# Altium schematic sheet esp32.SchDoc
size A; SheetNumber: 3; SheetTotal: 4
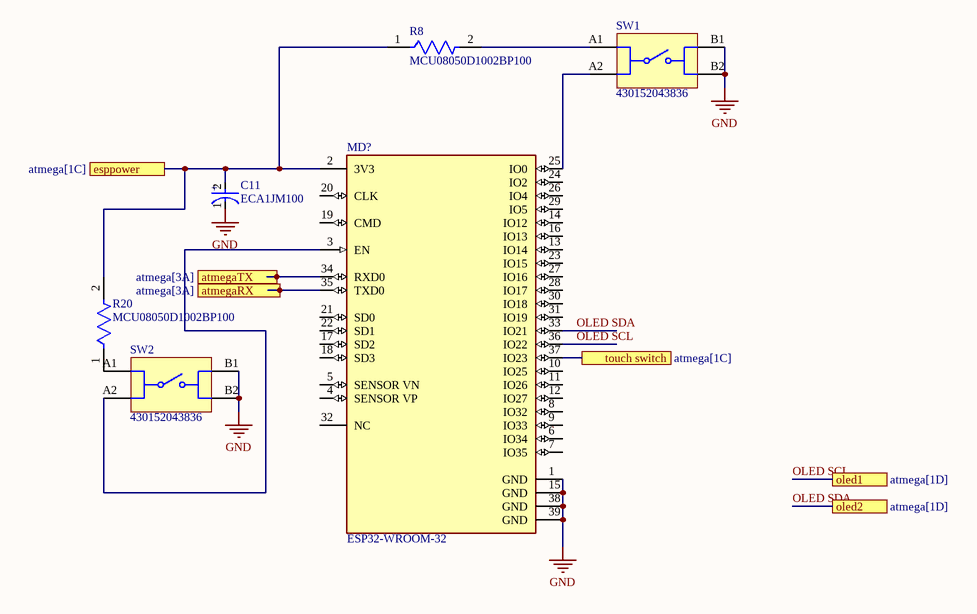
[diagram p0: esp32.SchDoc]

## Parts
C11  ECA1JM100  [FP-RAD-TH-D_5_0_5-L_11_1-MFG]
MD?  ESP32-WROOM-32  [FP-ESP32-WROOM-32-MFG]
R8  MCU08050D1002BP100  [FP-MCU0805-IPC_C]
R20  MCU08050D1002BP100  [FP-MCU0805-IPC_C]
SW1  430152043836  [WS-TASV_L6W6H4.3_4301x20438x6]
SW2  430152043836  [WS-TASV_L6W6H4.3_4301x20438x6]

## Ports
atmegaRX (see atmega[3A]), atmegaTX (see atmega[3A]), esppower (see atmega[1C]), oled1 (see atmega[1D]), oled2 (see atmega[1D]), touch switch (see atmega[1C])

## Nets
GND: C11.1(C) MD?.1(GND) MD?.15(GND) MD?.38(GND) MD?.39(GND) SW1.B1 SW1.B2 SW2.B1 SW2.B2
atmegaRX: MD?.35(TXD0) ; port atmegaRX
atmegaTX: MD?.34(RXD0) ; port atmegaTX
esppower: C11.2(A) MD?.2(3V3) R8.1 R20.2 ; port esppower
OLED SCL: MD?.36(IO22) ; port oled1
OLED SDA: MD?.33(IO21) ; port oled2
touch switch: MD?.37(IO23) ; port touch switch
NetMD?_3: MD?.3(EN) SW2.A2
NetMD?_25: MD?.25(IO0) SW1.A2
NetR8_2: R8.2 SW1.A1
NetR20_1: R20.1 SW2.A1

Not connected (* = marked no-connect by the designer): MD? 4(SENSOR_VP) 5(SENSOR_VN) 6(IO34) 7(IO35) 8(IO32) 9(IO33) 10(IO25) 11(IO26) 12(IO27) 13(IO14) 14(IO12) 16(IO13) 17(SD2) 18(SD3) 19(CMD) 20(CLK) 21(SD0) 22(SD1) 23(IO15) 24(IO2) 26(IO4) 27(IO16) 28(IO17) 29(IO5) 30(IO18) 31(IO19) 32(NC)

## Notes on the sheet
- (in symbol CMP-05427-001517-1) +

## Library data of the parts
C11 = CMP-05427-001517-1: Aluminum Electrolytic Capacitors (Radial Lead Type) 10uF ±20% 63V; Life (Hours): 2000Hour; Dielectric Material: Aluminium; Lead/Base Style: Straight; Ripple Current: 70mA; Dissipation Factor: 0.11%; Leakage Current: 3uA; Lead Diameter: 0.5mm; Max Operating Temperature: 85°C; Capacitance: 10uF; Voltage Rating: 63V; Packaging: Bulk; Radiation Hardening: No; Tolerance: 20%; Height: 11mm; Mount: Through Hole; Voltage: 63V; Voltage Rating (DC): 63V; Lead Pitch: 2mm; RoHS Compliant: Yes; Diameter: 5mm; Package Quantity: 200; Length: 11mm; Case/Package: Radial; Min Operating Temperature: -40°C; Construction: RADIAL; Height - Seated (Max): 0.472inch; Lead Free: Lead Free; Termination: Radial; Width: 5mm; Series: M; REACH SVHC: No SVHC
MD? = CMP-194065-000008-1: RX TXRX MOD WIFI SURFACE MOUNT; Frequency: 2.5GHz; Sensitivity: -98dBm; Operating Supply Voltage: 3.6V; Data Rate: 150Mbps; Weight: 0.088185oz; Package Quantity: 550; Min Operating Temperature: -40°C; Mount: Surface Mount; Max Operating Temperature: 85°C; Packaging: Cut Tape; Case/Package: SMD/SMT
R8 R20 = CMP-02407-010458-1: RES 1.05K OHM 0.5% 1/5W 0805; Power Rating: 125mW; Voltage Rating (DC): 100V; Tolerance: 0.1%; Resistance: 10kR; Temperature Coefficient: 25ppm/°C; Min Operating Temperature: -55°C; Military Standard: Not; Composition: Thin Film; Max Power Dissipation: 125mW; Lead Free: Lead Free; Case/Package: 0805; Contact Plating: Tin; Depth: 1.25mm; Number of Terminations: 2; Height: 0.022inch; Package Quantity: 1000; Max Operating Temperature: 125°C; Packaging: Tape and Reel; Mount: Surface Mount; Radiation Hardening: No; Length: 2mm; Width: 0.049inch
SW1 SW2 = CMP-1452-00002-2: NexarPartId: 22861785; Voltage Rating: 12V; Current Rating: 50mA; Switch Travel: 250µm; Switch Function: Off-Mom; Actuator Material: Liquid Crystal Polymer, Polymer; Insulation Resistance: 100MΩ; Actuator Length: 900µm; Throw Configuration: SPST; Mechanical Life: 200kcycles; Illumination Type: Illuminated, Non-Illuminated; Mount: Surface Mount; Max Operating Temperature: 85°C; Height: 4.3mm; RoHS: Compliant; Length: 6.2mm; Color: Orange; Width: 6.2mm; Contact Current Rating: 50mA; Diameter: 3.5mm; Termination: Gull Wing; Packaging: Tape and Reel; REACH SVHC: No SVHC; Contact Plating: Silver; Min Operating Temperature: -40°C; Contact Material: Stainless Steel, Steel